# Altium project TesisDextra.PrjPCB
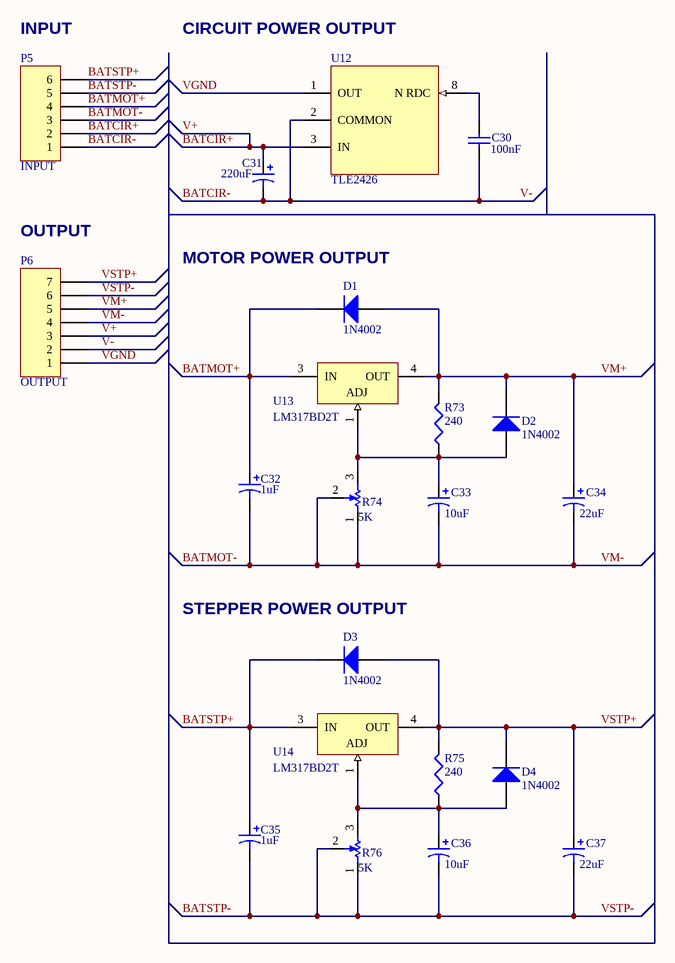
[diagram p0: PowerScr.SchDoc]
5 sheets, 228 parts. Net scope: global (net labels, ports and power ports of the same name join across sheets).
Sheets:
  PowerScr.SchDoc
  EmgAcq.SchDoc
  MDrive.SchDoc
  Hand Sensors.SchDoc
  MCUPro.SchDoc

## Sheet PowerScr.SchDoc: Power Scr Dextra
size A4 portrait; Author: Julio Alvarez D; DrawnBy: Julio Alvarez

### Parts
C30  value 100nF  [RAD-0.2]  (hidden comment: Cap)
C31  value 220uF  [C100UFB]  (hidden comment: Cap Pol1)
C32  value 1uF  [3528]  (hidden comment: 593D105X0020B2)
C33  value 10uF  [7343]  (hidden comment: 593D226X0020D2)
C34  value 22uF  [7343]  (hidden comment: 593D226X0020D2)
C35  value 1uF  [3528]  (hidden comment: 593D105X0020B2)
C36  value 10uF  [7343]  (hidden comment: 593D226X0020D2)
C37  value 22uF  [7343]  (hidden comment: 593D226X0020D2)
D1  1N4002  [DO-41]
D2  1N4002  [DO-41]
D3  1N4002  [DO-41]
D4  1N4002  [DO-41]
P5  INPUT  [AZUL5-6]
P6  OUTPUT  [AZUL5-7]
R73  value 240  [RESC6332M]  (hidden comment: Res3)
R74  value 5K  [3361P]  (hidden comment: POT3361)
R75  value 240  [RESC6332M]  (hidden comment: Res3)
R76  value 5K  [3361P]  (hidden comment: POT3361)
U12  TLE2426  [SOP8 - duplicate]
U13  LM317BD2T  [936-03]
U14  LM317BD2T  [936-03]

### Nets
BATMOT-: C32.2 C33.2 C34.2 C35.2 C36.2 C37.2 P5.3 P5.5 P6.1 P6.4 P6.6 R74.1 R74.2 R76.1 R76.2 U12.1(OUT)  [also labelled BATSTP-, VGND, VM-, VSTP-]
BATCIR+: C31.1 P5.2 P6.3 U12.3(IN)  [also labelled V+]
BATCIR-: C30.1 C31.2 P5.1 P6.2 U12.2(COMMON)  [also labelled V-]
BATMOT+: C32.1 D1.2(K) P5.4 U13.3(IN)
BATSTP+: C35.1 D3.2(K) P5.6 U14.3(IN)
VM+: C34.1 D1.1(A) D2.2(K) P6.5 R73.2 U13.4(OUT)
VSTP+: C37.1 D3.1(A) D4.2(K) P6.7 R75.2 U14.4(OUT)
NetC30_2: C30.2 U12.8(N_RDC)
NetC33_1: C33.1 D2.1(A) R73.1 R74.3 U13.1(ADJ)
NetC36_1: C36.1 D4.1(A) R75.1 R76.3 U14.1(ADJ)

Not connected (* = marked no-connect by the designer): U12 4(NC) 5(NC) 6(NC) 7(NC)

### Notes on the sheet
- (near P5) INPUT
- CIRCUIT POWER OUTPUT
- (near P6) OUTPUT
- MOTOR POWER OUTPUT
- (near D3) STEPPER POWER OUTPUT

### Library data of the parts
C30 = Cap: Capacitor; Published: 8-Jun-2000; LatestRevisionDate: 17-Jul-2002; LatestRevisionNote: Re-released for DXP Platform.; PackageReference: RAD-0.3; Publisher: Altium Limited; PackageDescription: Radial Cap, Thru-Hole; 2 Leads; 0.3 in Pin Spacing
C31 = Cap Pol1: Polarized Capacitor (Radial); Published: 8-Jun-2000; LatestRevisionDate: 17-Jul-2002; LatestRevisionNote: Re-released for DXP Platform.; PackageReference: RB7.6-15; Publisher: Altium Limited; PackageDescription: Polarized Capacitor (Radial); 2 Leads
C32 C35 = 593D106X0020B2: Tantamount Commercial, Surface Mount Solid Tantalum Chip Capacitor for Switch Mode Power Supplies and Converters: 10uF, 20% Tolerance, 20 WVDC @ +85°C, Surge = 26V; Note: See Data Sheet for full range of components; Published: 19-Mar-2004; DatasheetDocument: 04-Mar-2003; PackageReference: 3528; Publisher: Altium Limited; Code_JEITA: 3528; ComponentLink1Description: Manufacturer Link; ComponentLink1URL: http://www.vishay.com/; ComponentLink2Description: Datasheet; ComponentLink2URL: http://www.vishay.com/docs/40005/593.pdf
C33 C34 C36 C37 = 593D226X0020D2: Tantamount Commercial, Surface Mount Solid Tantalum Chip Capacitor for Switch Mode Power Supplies and Converters: 22uF, 20% Tolerance, 20 WVDC @ +85°C, Surge = 26V; Note: See Data Sheet for full range of components; Published: 19-Mar-2004; DatasheetDocument: 04-Mar-2003; PackageReference: 7343; Publisher: Altium Limited; Code_JEITA: 7343; ComponentLink1Description: Manufacturer Link; ComponentLink1URL: http://www.vishay.com/; ComponentLink2Description: Datasheet; ComponentLink2URL: http://www.vishay.com/docs/40005/593.pdf
D1-D4 = Diode 1N4002: 1 Amp General Purpose Rectifier; Published: 8-Jun-2000; LatestRevisionDate: 17-Jul-2002; LatestRevisionNote: Re-released for DXP Platform.; DatasheetVersion: 1998; PackageVersion: Aug-1999; PackageReference: DO-41; Publisher: Altium Limited; PackageDescription: Diode, Axial; Body 5.2 x 2.7 mm (LxDia. max), Lead Dia. 0.86 mm (max); Code_JEDEC: DO-204-AL; ComponentLink1Description: Manufacturer Link; ComponentLink1URL: http://www.fairchildsemi.com/; ComponentLink2Description: Datasheet; ComponentLink2URL: http://www.fairchildsemi.com/ds/1N%2F1N4001.pdf
P5 = Header 6: Header, 6-Pin; LatestRevisionDate: 17-Jul-2002; LatestRevisionNote: Re-released for DXP Platform.; Publisher: Altium Limited
P6 = Header 7: Header, 7-Pin; LatestRevisionDate: 17-Jul-2002; LatestRevisionNote: Re-released for DXP Platform.; Publisher: Altium Limited
R73 R75 = Res3: Resistor; Published: 8-Jun-2000; LatestRevisionDate: 29-May-2009; LatestRevisionNote: IPC-7351 Footprint Added.; PackageReference: J1-0603; Publisher: Altium Limited; PackageDescription: Chip Resistor
U12 = TLE2426: Precision Virtual Ground
U13 U14 = LM317BD2T: Three-Terminal Adjustable Output Positive Voltage Regulator; Note: Pin 2 is electrically connected to Pin 4; Pin 4 is heasink; Published: 15-Apr-2002; DatasheetVersion: 1996; PackageVersion: 1997; PackageReference: 936-03; Publisher: Altium Limited; PackageDescription: D2-PAK/TO-263-AB; 3 Leads (1 Cropped); Body 14.7 (inc. leads) x 10.2 mm (LxW max); ComponentLink1Description: Manufacturer Link; ComponentLink1URL: http://www.onsemi.com/site/products/taxonomy/0,4438,503,00.html; ComponentLink2Description: Datasheet; ComponentLink2URL: http://www.onsemi.com/pub/Collateral/LM317-D.PDF

## Sheet EmgAcq.SchDoc: EMG ACQ-4
size A3; DrawnBy: Julio Alvarez D
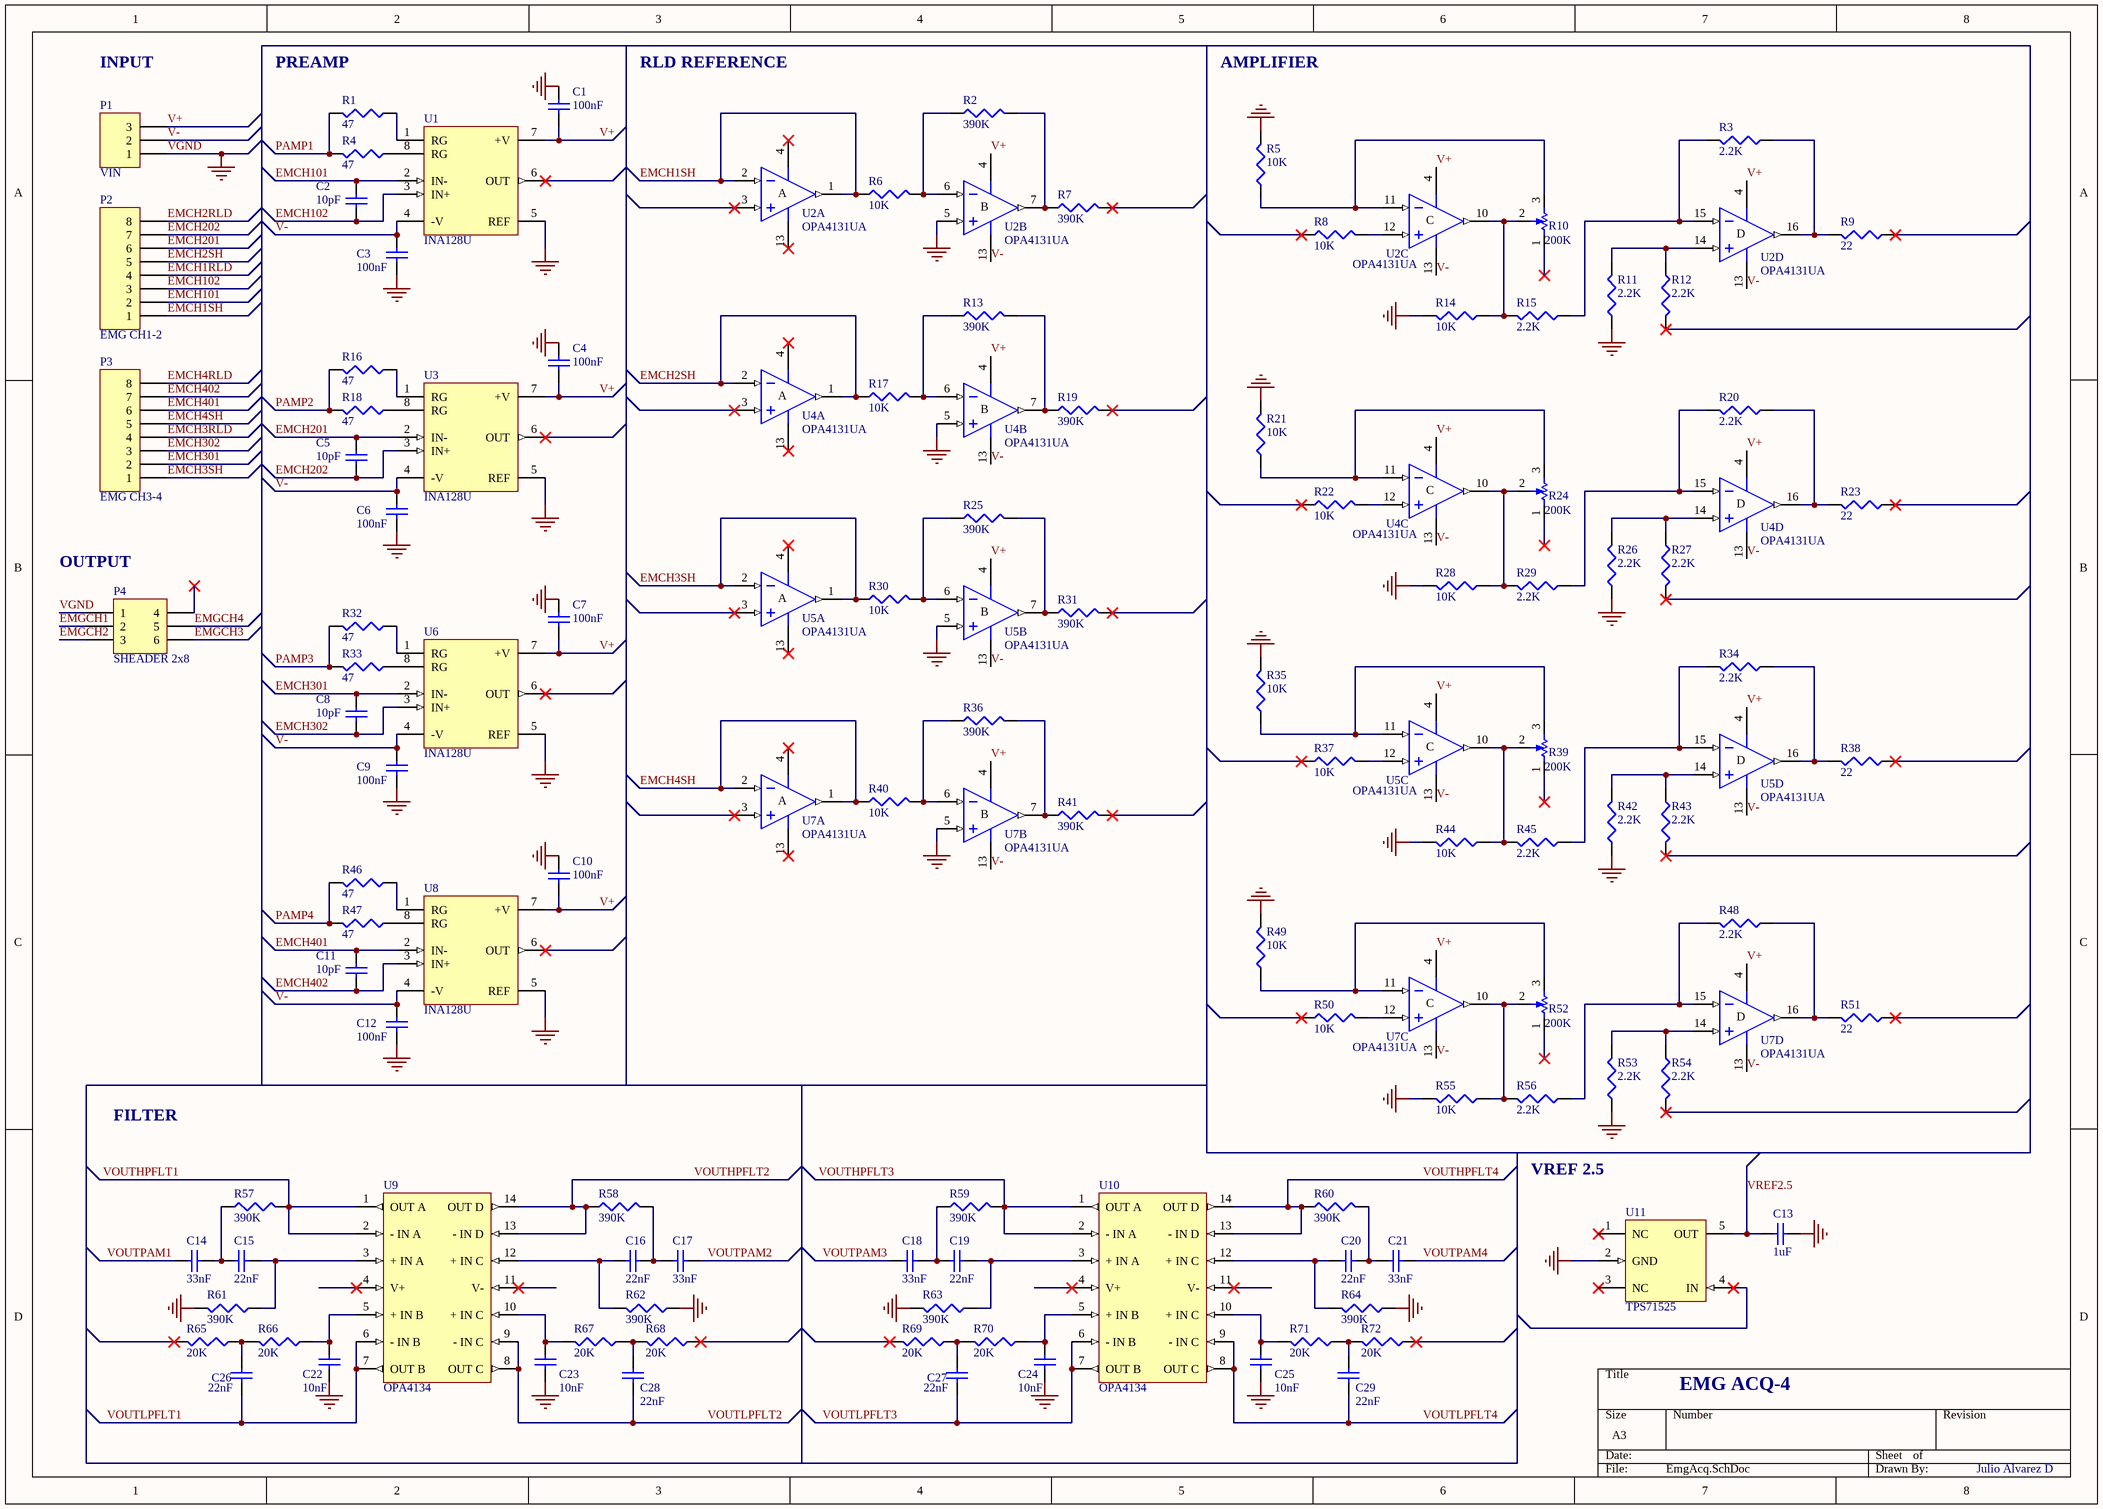
[diagram p1: EmgAcq.SchDoc]

### Parts
C1  value 100nF  [C1206]  (hidden comment: Cap Semi)
C2  value 10pF  [C1206]  (hidden comment: Cap Semi)
C3  value 100nF  [C1206]  (hidden comment: Cap Semi)
C4  value 100nF  [C1206]  (hidden comment: Cap Semi)
C5  value 10pF  [C1206]  (hidden comment: Cap Semi)
C6  value 100nF  [C1206]  (hidden comment: Cap Semi)
C7  value 100nF  [C1206]  (hidden comment: Cap Semi)
C8  value 10pF  [C1206]  (hidden comment: Cap Semi)
C9  value 100nF  [C1206]  (hidden comment: Cap Semi)
C10  value 100nF  [C1206]  (hidden comment: Cap Semi)
C11  value 10pF  [C1206]  (hidden comment: Cap Semi)
C12  value 100nF  [C1206]  (hidden comment: Cap Semi)
C13  value 1uF  [CAPC2012M]  (hidden comment: Cap Semi)
C14  value 33nF  [C1206]  (hidden comment: Cap Semi)
C15  value 22nF  [1608[0603]]  (hidden comment: Cap Semi)
C16  value 22nF  [1608[0603]]  (hidden comment: Cap Semi)
C17  value 33nF  [C1206]  (hidden comment: Cap Semi)
C18  value 33nF  [C1206]  (hidden comment: Cap Semi)
C19  value 22nF  [1608[0603]]  (hidden comment: Cap Semi)
C20  value 22nF  [1608[0603]]  (hidden comment: Cap Semi)
C21  value 33nF  [C1206]  (hidden comment: Cap Semi)
C22  value 10nF  [C1206]  (hidden comment: Cap Semi)
C23  value 10nF  [C1206]  (hidden comment: Cap Semi)
C24  value 10nF  [C1206]  (hidden comment: Cap Semi)
C25  value 10nF  [C1206]  (hidden comment: Cap Semi)
C26  value 22nF  [1608[0603]]  (hidden comment: Cap Semi)
C27  value 22nF  [1608[0603]]  (hidden comment: Cap Semi)
C28  value 22nF  [1608[0603]]  (hidden comment: Cap Semi)
C29  value 22nF  [1608[0603]]  (hidden comment: Cap Semi)
P1  VIN  [AZUL5-3]
P2  EMG CH1-2  [AZUL5-8]
P3  EMG CH3-4  [AZUL5-8]
P4  SHEADER 2x8  [SHBH 2x3]
R1  value 47  [RESC3225M]  (hidden comment: Res3)
R2  value 390K  [RESC3225M]  (hidden comment: Res3)
R3  value 2.2K  [RESC3225M]  (hidden comment: Res3)
R4  value 47  [RESC3225M]  (hidden comment: Res3)
R5  value 10K  [RESC3225M]  (hidden comment: Res3)
R6  value 10K  [RESC3225M]  (hidden comment: Res3)
R7  value 390K  [RESC3225M]  (hidden comment: Res3)
R8  value 10K  [RESC3225M]  (hidden comment: Res3)
R9  value 22  [RESC3225M]  (hidden comment: Res3)
R10  POT3361  [3361P]  (value not drawn)
R11  value 2.2K  [RESC3225M]  (hidden comment: Res3)
R12  value 2.2K  [RESC3225M]  (hidden comment: Res3)
R13  value 390K  [RESC3225M]  (hidden comment: Res3)
R14  value 10K  [RESC3225M]  (hidden comment: Res3)
R15  value 2.2K  [RESC3225M]  (hidden comment: Res3)
R16  value 47  [RESC3225M]  (hidden comment: Res3)
R17  value 10K  [RESC3225M]  (hidden comment: Res3)
R18  value 47  [RESC3225M]  (hidden comment: Res3)
R19  value 390K  [RESC3225M]  (hidden comment: Res3)
R20  value 2.2K  [RESC3225M]  (hidden comment: Res3)
R21  value 10K  [RESC3225M]  (hidden comment: Res3)
R22  value 10K  [RESC3225M]  (hidden comment: Res3)
R23  value 22  [RESC3225M]  (hidden comment: Res3)
R24  POT3361  [3361P]  (value not drawn)
R25  value 390K  [RESC3225M]  (hidden comment: Res3)
R26  value 2.2K  [RESC3225M]  (hidden comment: Res3)
R27  value 2.2K  [RESC3225M]  (hidden comment: Res3)
R28  value 10K  [RESC3225M]  (hidden comment: Res3)
R29  value 2.2K  [RESC3225M]  (hidden comment: Res3)
R30  value 10K  [RESC3225M]  (hidden comment: Res3)
R31  value 390K  [RESC3225M]  (hidden comment: Res3)
R32  value 47  [RESC3225M]  (hidden comment: Res3)
R33  value 47  [RESC3225M]  (hidden comment: Res3)
R34  value 2.2K  [RESC3225M]  (hidden comment: Res3)
R35  value 10K  [RESC3225M]  (hidden comment: Res3)
R36  value 390K  [RESC3225M]  (hidden comment: Res3)
R37  value 10K  [RESC3225M]  (hidden comment: Res3)
R38  value 22  [RESC3225M]  (hidden comment: Res3)
R39  POT3361  [3361P]  (value not drawn)
R40  value 10K  [RESC3225M]  (hidden comment: Res3)
R41  value 390K  [RESC3225M]  (hidden comment: Res3)
R42  value 2.2K  [RESC3225M]  (hidden comment: Res3)
R43  value 2.2K  [RESC3225M]  (hidden comment: Res3)
R44  value 10K  [RESC3225M]  (hidden comment: Res3)
R45  value 2.2K  [RESC3225M]  (hidden comment: Res3)
R46  value 47  [RESC3225M]  (hidden comment: Res3)
R47  value 47  [RESC3225M]  (hidden comment: Res3)
R48  value 2.2K  [RESC3225M]  (hidden comment: Res3)
R49  value 10K  [RESC3225M]  (hidden comment: Res3)
R50  value 10K  [RESC3225M]  (hidden comment: Res3)
R51  value 22  [RESC3225M]  (hidden comment: Res3)
R52  POT3361  [3361P]  (value not drawn)
R53  value 2.2K  [RESC3225M]  (hidden comment: Res3)
R54  value 2.2K  [RESC3225M]  (hidden comment: Res3)
R55  value 10K  [RESC3225M]  (hidden comment: Res3)
R56  value 2.2K  [RESC3225M]  (hidden comment: Res3)
R57  value 390K  [RESC3225M]  (hidden comment: Res3)
R58  value 390K  [RESC3225M]  (hidden comment: Res3)
R59  value 390K  [RESC3225M]  (hidden comment: Res3)
R60  value 390K  [RESC3225M]  (hidden comment: Res3)
R61  value 390K  [RESC3225M]  (hidden comment: Res3)
R62  value 390K  [RESC3225M]  (hidden comment: Res3)
R63  value 390K  [RESC3225M]  (hidden comment: Res3)
R64  value 390K  [RESC3225M]  (hidden comment: Res3)
R65  value 20K  [RESC3225M]  (hidden comment: Res3)
R66  value 20K  [RESC3225M]  (hidden comment: Res3)
R67  value 20K  [RESC3225M]  (hidden comment: Res3)
R68  value 20K  [RESC3225M]  (hidden comment: Res3)
R69  value 20K  [RESC3225M]  (hidden comment: Res3)
R70  value 20K  [RESC3225M]  (hidden comment: Res3)
R71  value 20K  [RESC3225M]  (hidden comment: Res3)
R72  value 20K  [RESC3225M]  (hidden comment: Res3)
U1  INA128U  [182H_N]
U2  OPA4131UA  [211F_N]  (parts A,B,C,D of 4)
U3  INA128U  [182H_N]
U4  OPA4131UA  [211F_N]  (parts A,B,C,D of 4)
U5  OPA4131UA  [211F_N]  (parts A,B,C,D of 4)
U6  INA128U  [182H_N]
U7  OPA4131UA  [211F_N]  (parts A,B,C,D of 4)
U8  INA128U  [182H_N]
U9  OPA4134  [SOIC127P600-14M]
U10  OPA4134  [SOIC127P600-14M]
U11  TPS71525  [SOT353-5L]

### Nets
GND: C1.2 C3.1 C4.2 C6.1 C7.2 C9.1 C10.2 C12.1 C13.2 C22.1 C23.1 C24.1 C25.1 P1.1 P4.1 R5.1 R11.2 R14.1 R21.1 R26.2 R28.1 R35.1 R42.2 R44.1 R49.1 R53.2 R55.1 R61.2 R62.2 R63.2 R64.2 U1.5(REF) U2.5(IN+) U3.5(REF) U4.5(IN+) U5.5(IN+) U6.5(REF) U7.5(IN+) U8.5(REF) U11.2(GND)  [also labelled VGND]  [project net BATMOT-]
EMCH1RLD: P2.4
EMCH1SH: P2.1 R6.1 U2.1(OUT) U2.2(IN-)
EMCH2RLD: P2.8
EMCH2SH: P2.5 R17.1 U4.1(OUT) U4.2(IN-)
EMCH3RLD: P3.4
EMCH3SH: P3.1 R30.1 U5.1(OUT) U5.2(IN-)
EMCH4RLD: P3.8
EMCH4SH: P3.5 R40.1 U7.1(OUT) U7.2(IN-)
EMCH101: C2.2 P2.2 U1.2(IN-)
EMCH102: C2.1 P2.3 U1.3(IN+)
EMCH201: C5.2 P2.6 U3.2(IN-)
EMCH202: C5.1 P2.7 U3.3(IN+)
EMCH301: C8.2 P3.2 U6.2(IN-)
EMCH302: C8.1 P3.3 U6.3(IN+)
EMCH401: C11.2 P3.6 U8.2(IN-)
EMCH402: C11.1 P3.7 U8.3(IN+)
EMGCH1: P4.2
EMGCH2: P4.3
EMGCH3: P4.6
EMGCH4: P4.5
PAMP1: R1.2 R4.2
PAMP2: R16.2 R18.2
PAMP3: R32.2 R33.2
PAMP4: R46.2 R47.2
V+: C1.1 C4.1 C7.1 C10.1 P1.3 U1.7(+V) U2.4(V+) U3.7(+V) U4.4(V+) U5.4(V+) U6.7(+V) U7.4(V+) U8.7(+V)  [project net BATCIR+]
V-: C3.2 C6.2 C9.2 C12.2 P1.2 U1.4(-V) U2.13(V-) U3.4(-V) U4.13(V-) U5.13(V-) U6.4(-V) U7.13(V-) U8.4(-V)  [project net BATCIR-]
VOUTHPFLT1: R57.2 U9.1(OUT_A) U9.2(-_IN_A)
VOUTHPFLT2: R58.2 U9.13(-_IN_D) U9.14(OUT_D)
VOUTHPFLT3: R59.2 U10.1(OUT_A) U10.2(-_IN_A)
VOUTHPFLT4: R60.2 U10.13(-_IN_D) U10.14(OUT_D)
VOUTLPFLT1: C26.1 U9.6(-_IN_B) U9.7(OUT_B)
VOUTLPFLT2: C28.1 U9.8(OUT_C) U9.9(-_IN_C)
VOUTLPFLT3: C27.1 U10.6(-_IN_B) U10.7(OUT_B)
VOUTLPFLT4: C29.1 U10.8(OUT_C) U10.9(-_IN_C)
VOUTPAM1: C14.2
VOUTPAM2: C17.2
VOUTPAM3: C18.2
VOUTPAM4: C21.2
VREF2.5: C13.1 U11.5(OUT)
NetC14_1: C14.1 C15.2 R57.1
NetC15_1: C15.1 R61.1 U9.3(+_IN_A)
NetC16_1: C16.1 R62.1 U9.12(+_IN_C)
NetC16_2: C16.2 C17.1 R58.1
NetC18_1: C18.1 C19.2 R59.1
NetC19_1: C19.1 R63.1 U10.3(+_IN_A)
NetC20_1: C20.1 R64.1 U10.12(+_IN_C)
NetC20_2: C20.2 C21.1 R60.1
NetC22_2: C22.2 R66.1 U9.5(+_IN_B)
NetC23_2: C23.2 R67.1 U9.10(+_IN_C)
NetC24_2: C24.2 R70.1 U10.5(+_IN_B)
NetC25_2: C25.2 R71.1 U10.10(+_IN_C)
NetC26_2: C26.2 R65.1 R66.2
NetC27_2: C27.2 R69.1 R70.2
NetC28_2: C28.2 R67.2 R68.1
NetC29_2: C29.2 R71.2 R72.1
NetR1_1: R1.1 U1.1(RG)
NetR2_1: R2.1 R6.2 U2.6(IN-)
NetR2_2: R2.2 R7.1 U2.7(OUT)
NetR3_1: R3.1 R15.2 U2.15(IN-)
NetR3_2: R3.2 R9.1 U2.16(OUT)
NetR4_1: R4.1 U1.8(RG)
NetR5_2: R5.2 R10.3 U2.11(IN-)
NetR8_1: R8.1 U2.12(IN+)
NetR10_2: R10.2 R14.2 R15.1 U2.10(OUT)
NetR11_1: R11.1 R12.2 U2.14(IN+)
NetR13_1: R13.1 R17.2 U4.6(IN-)
NetR13_2: R13.2 R19.1 U4.7(OUT)
NetR16_1: R16.1 U3.1(RG)
NetR18_1: R18.1 U3.8(RG)
NetR20_1: R20.1 R29.2 U4.15(IN-)
NetR20_2: R20.2 R23.1 U4.16(OUT)
NetR21_2: R21.2 R24.3 U4.11(IN-)
NetR22_1: R22.1 U4.12(IN+)
NetR24_2: R24.2 R28.2 R29.1 U4.10(OUT)
NetR25_1: R25.1 R30.2 U5.6(IN-)
NetR25_2: R25.2 R31.1 U5.7(OUT)
NetR26_1: R26.1 R27.2 U4.14(IN+)
NetR32_1: R32.1 U6.1(RG)
NetR33_1: R33.1 U6.8(RG)
NetR34_1: R34.1 R45.2 U5.15(IN-)
NetR34_2: R34.2 R38.1 U5.16(OUT)
NetR35_2: R35.2 R39.3 U5.11(IN-)
NetR36_1: R36.1 R40.2 U7.6(IN-)
NetR36_2: R36.2 R41.1 U7.7(OUT)
NetR37_1: R37.1 U5.12(IN+)
NetR39_2: R39.2 R44.2 R45.1 U5.10(OUT)
NetR42_1: R42.1 R43.2 U5.14(IN+)
NetR46_1: R46.1 U8.1(RG)
NetR47_1: R47.1 U8.8(RG)
NetR48_1: R48.1 R56.2 U7.15(IN-)
NetR48_2: R48.2 R51.1 U7.16(OUT)
NetR49_2: R49.2 R52.3 U7.11(IN-)
NetR50_1: R50.1 U7.12(IN+)
NetR52_2: R52.2 R55.2 R56.1 U7.10(OUT)
NetR53_1: R53.1 R54.2 U7.14(IN+)

Not connected (* = marked no-connect by the designer): P4 4*; R7 2*; R8 2*; R9 2*; R10 1*; R12 1*; R19 2*; R22 2*; R23 2*; R24 1*; R27 1*; R31 2*; R37 2*; R38 2*; R39 1*; R41 2*; R43 1*; R50 2*; R51 2*; R52 1*; R54 1*; R65 2*; R68 2*; R69 2*; R72 2*; U1 6(OUT)*; U2 3(IN+)*; U3 6(OUT)*; U4 3(IN+)*; U5 3(IN+)*; U6 6(OUT)*; U7 3(IN+)*; U8 6(OUT)*; U9 4(V+)* 11(V-)*; U10 4(V+)* 11(V-)*; U11 1(NC)* 3(NC)* 4(IN)*

### Notes on the sheet
- INPUT
- (near R1) PREAMP
- RLD REFERENCE
- AMPLIFIER
- (near P4) OUTPUT
- FILTER
- VREF 2.5
- (in symbol OPA4131UA, part A) A
- (in symbol OPA4131UA, part B) B
- (in symbol OPA4131UA, part C) C
- (in symbol OPA4131UA, part D) D
- (in symbol POT3361) 200K

### Library data of the parts
C1-C29 = Cap Semi: Capacitor (Semiconductor SIM Model); Published: 8-Jun-2000; LatestRevisionDate: 29-May-2009; LatestRevisionNote: IPC-7351 Footprint Added.; PackageReference: C1206; Publisher: Altium Limited; PackageDescription: Chip Capacitor
P1 = Header 3: Header, 3-Pin; LatestRevisionDate: 17-Jul-2002; LatestRevisionNote: Re-released for DXP Platform.; Publisher: Altium Limited
P2 P3 = Header 8: Header, 8-Pin; LatestRevisionDate: 17-Jul-2002; LatestRevisionNote: Re-released for DXP Platform.; Publisher: Altium Limited
P4 = SB Header 2x3: Shrouded Box Header: 2x8-Pin, 0.100" (2.54 mm) Male
R1-R9 R11-R23 R25-R38 R40-R51 R53-R72 = Res3: Resistor; Published: 8-Jun-2000; LatestRevisionDate: 29-May-2009; LatestRevisionNote: IPC-7351 Footprint Added.; PackageReference: J1-0603; Publisher: Altium Limited; PackageDescription: Chip Resistor
U1 U3 U6 U8 = INA128U: Precision, Low-Power Instrumentation Amplifiers; Published: 8-Jun-2000; LatestRevisionDate: 13-Apr-2006; LatestRevisionNote: IPC-7351 Footprint Added.; DatasheetVersion: Oct-1996; PackageReference: 182H; Publisher: Altium Limited; PackageDescription: 8-Pin Small Outline Integrated Circuit 1.27 mm Pitch; Code_JEDEC: MS-012-AA; Code_IPC: SOIC127P600-8; ComponentLink1Description: Manufacturer Link; ComponentLink1URL: http://www.ti.com/; ComponentLink2Description: Datasheet; ComponentLink2URL: http://www-s.ti.com/sc/ds/INA128.pdf
U2 U4 U5 U7 = OPA4131UA: General Purpose FET-Input Operational Amplifiers; Note: Pins 8 and 9 are No internal Connection (NC) pins and are not drawn.; Published: 8-Jun-2000; LatestRevisionDate: 13-Apr-2006; LatestRevisionNote: IPC-7351 Footprint Added.; DatasheetVersion: Jan-1996; PackageReference: 211F; Publisher: Altium Limited; PackageDescription: 16-Pin Small Outline Integrated Circuit 1.27 mm Pitch; Code_JEDEC: MS-013-AA; Code_IPC: SOIC127P1030-16; ComponentLink1Description: Manufacturer Link; ComponentLink1URL: http://www.ti.com/; ComponentLink2Description: Datasheet; ComponentLink2URL: http://www-s.ti.com/sc/ds/OPA131.pdf

## Sheet MDrive.SchDoc: M Drive M8S1
size A4 portrait
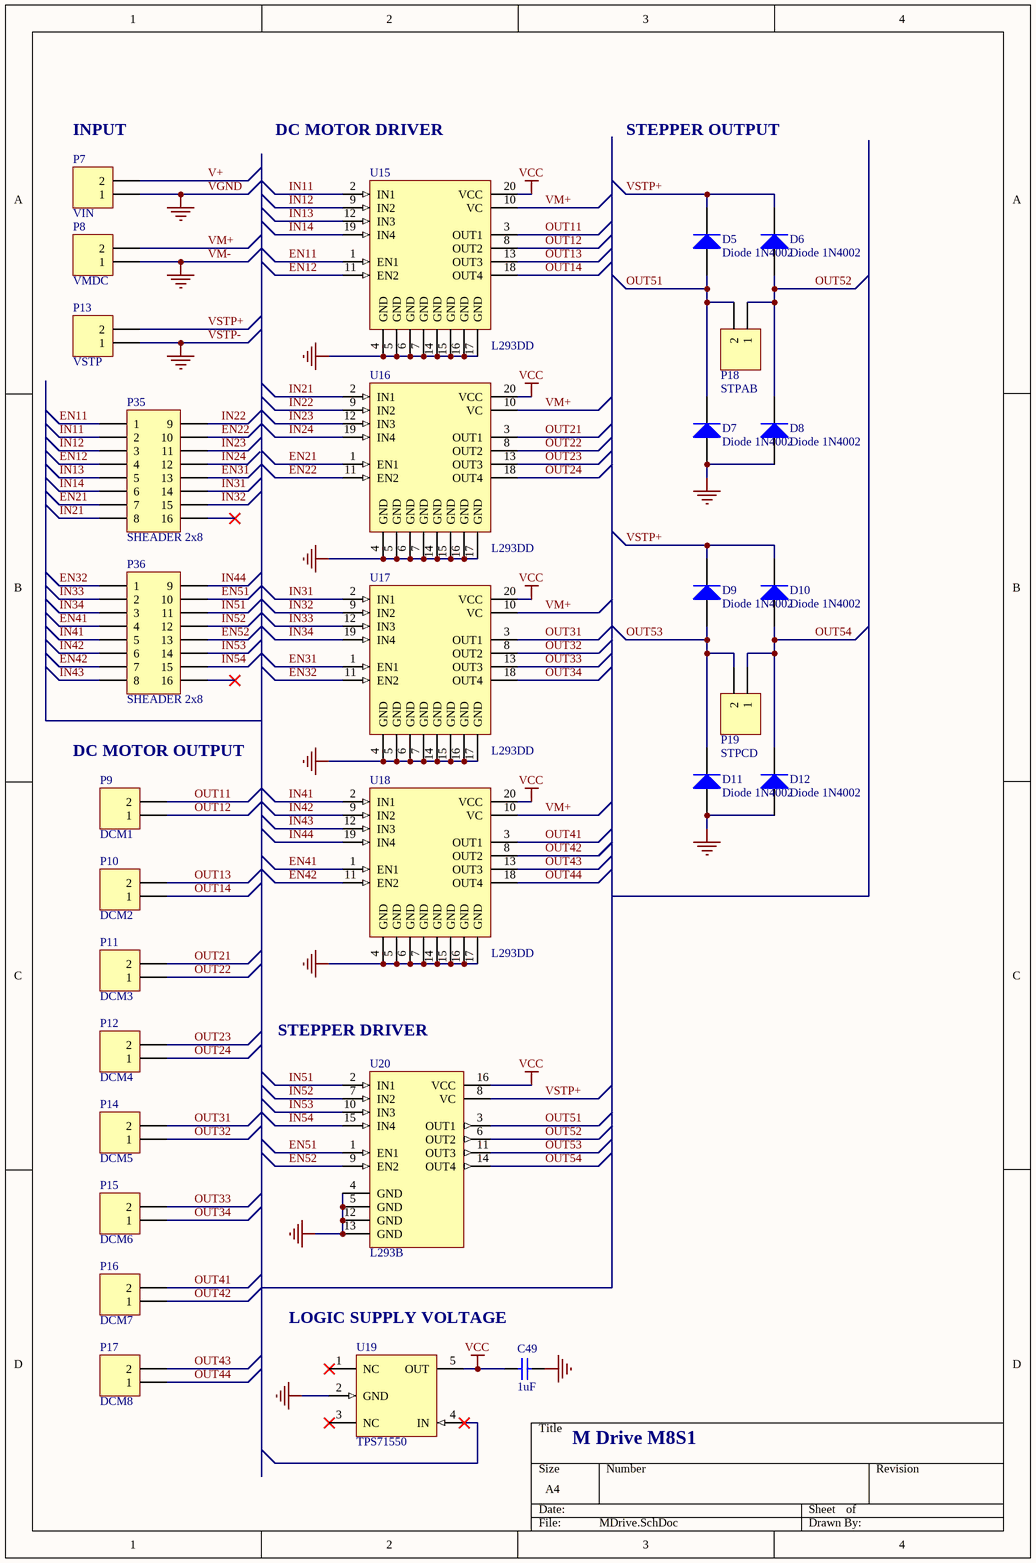
[diagram p2: MDrive.SchDoc]

### Parts
C49  value 1uF  [CAPC2012M]  (hidden comment: Cap Semi)
D5  Diode 1N4002  [DO-41]
D6  Diode 1N4002  [DO-41]
D7  Diode 1N4002  [DO-41]
D8  Diode 1N4002  [DO-41]
D9  Diode 1N4002  [DO-41]
D10  Diode 1N4002  [DO-41]
D11  Diode 1N4002  [DO-41]
D12  Diode 1N4002  [DO-41]
P7  VIN  [AZUL5-2]
P8  VMDC  [AZUL5-2]
P9  DCM1  [AZUL5-2]
P10  DCM2  [AZUL5-2]
P11  DCM3  [AZUL5-2]
P12  DCM4  [AZUL5-2]
P13  VSTP  [AZUL5-2]
P14  DCM5  [AZUL5-2]
P15  DCM6  [AZUL5-2]
P16  DCM7  [AZUL5-2]
P17  DCM8  [AZUL5-2]
P18  STPAB  [AZUL5-2]
P19  STPCD  [AZUL5-2]
P35  SHEADER 2x8  [SHBH 2X8]
P36  SHEADER 2x8  [SHBH 2X8]
U15  L293DD  [SO20_N]
U16  L293DD  [SO20_N]
U17  L293DD  [SO20_N]
U18  L293DD  [SO20_N]
U19  TPS71550  [SOT353-5L]
U20  L293B  [DIP16]

### Nets
GND: C49.2 D7.1(A) D8.1(A) D11.1(A) D12.1(A) P7.1 P8.1 P13.1 U15.4(GND) U15.5(GND) U15.6(GND) U15.7(GND) U15.14(GND) U15.15(GND) U15.16(GND) U15.17(GND) U16.4(GND) U16.5(GND) U16.6(GND) U16.7(GND) U16.14(GND) U16.15(GND) U16.16(GND) U16.17(GND) U17.4(GND) U17.5(GND) U17.6(GND) U17.7(GND) U17.14(GND) U17.15(GND) U17.16(GND) U17.17(GND) U18.4(GND) U18.5(GND) U18.6(GND) U18.7(GND) U18.14(GND) U18.15(GND) U18.16(GND) U18.17(GND) U19.2(GND) U20.4(GND) U20.5(GND) U20.12(GND) U20.13(GND)  [also labelled VGND, VM-, VSTP-]  [project net BATMOT-]
VCC: C49.1 U15.20(VCC) U16.20(VCC) U17.20(VCC) U18.20(VCC) U19.5(OUT) U20.16(VCC)  [project net FSR11]
EN11: P35.1 U15.1(EN1)
EN12: P35.4 U15.11(EN2)
EN21: P35.7 U16.1(EN1)
EN22: P35.10 U16.11(EN2)
EN31: P35.13 U17.1(EN1)
EN32: P36.1 U17.11(EN2)
EN41: P36.4 U18.1(EN1)
EN42: P36.7 U18.11(EN2)
EN51: P36.10 U20.1(EN1)
EN52: P36.13 U20.9(EN2)
IN11: P35.2 U15.2(IN1)
IN12: P35.3 U15.9(IN2)
IN13: P35.5 U15.12(IN3)
IN14: P35.6 U15.19(IN4)
IN21: P35.8 U16.2(IN1)
IN22: P35.9 U16.9(IN2)
IN23: P35.11 U16.12(IN3)
IN24: P35.12 U16.19(IN4)
IN31: P35.14 U17.2(IN1)
IN32: P35.15 U17.9(IN2)
IN33: P36.2 U17.12(IN3)
IN34: P36.3 U17.19(IN4)
IN41: P36.5 U18.2(IN1)
IN42: P36.6 U18.9(IN2)
IN43: P36.8 U18.12(IN3)
IN44: P36.9 U18.19(IN4)
IN51: P36.11 U20.2(IN1)
IN52: P36.12 U20.7(IN2)
IN53: P36.14 U20.10(IN3)
IN54: P36.15 U20.15(IN4)
OUT11: P9.2 U15.3(OUT1)
OUT12: P9.1 U15.8(OUT2)
OUT13: P10.2 U15.13(OUT3)
OUT14: P10.1 U15.18(OUT4)
OUT21: P11.2 U16.3(OUT1)
OUT22: P11.1 U16.8(OUT2)
OUT23: P12.2 U16.13(OUT3)
OUT24: P12.1 U16.18(OUT4)
OUT31: P14.2 U17.3(OUT1)
OUT32: P14.1 U17.8(OUT2)
OUT33: P15.2 U17.13(OUT3)
OUT34: P15.1 U17.18(OUT4)
OUT41: P16.2 U18.3(OUT1)
OUT42: P16.1 U18.8(OUT2)
OUT43: P17.2 U18.13(OUT3)
OUT44: P17.1 U18.18(OUT4)
OUT51: D5.1(A) D7.2(K) P18.2 U20.3(OUT1)
OUT52: D6.1(A) D8.2(K) P18.1 U20.6(OUT2)
OUT53: D9.1(A) D11.2(K) P19.2 U20.11(OUT3)
OUT54: D10.1(A) D12.2(K) P19.1 U20.14(OUT4)
V+: P7.2  [project net BATCIR+]
VM+: P8.2 U15.10(VC) U16.10(VC) U17.10(VC) U18.10(VC)
VSTP+: D5.2(K) D6.2(K) D9.2(K) D10.2(K) P13.2 U20.8(VC)

Not connected (* = marked no-connect by the designer): P35 16*; P36 16*; U19 1(NC)* 3(NC)* 4(IN)*

### Notes on the sheet
- (near P7) INPUT
- DC MOTOR DRIVER
- STEPPER OUTPUT
- DC MOTOR OUTPUT
- (near U20) STEPPER DRIVER
- (near U19) LOGIC SUPPLY VOLTAGE

### Library data of the parts
C49 = Cap Semi: Capacitor (Semiconductor SIM Model); Published: 8-Jun-2000; LatestRevisionDate: 29-May-2009; LatestRevisionNote: IPC-7351 Footprint Added.; PackageReference: C1206; Publisher: Altium Limited; PackageDescription: Chip Capacitor
D5-D12 = Diode 1N4002: 1 Amp General Purpose Rectifier; Published: 8-Jun-2000; LatestRevisionDate: 17-Jul-2002; LatestRevisionNote: Re-released for DXP Platform.; DatasheetVersion: 1998; PackageVersion: Aug-1999; PackageReference: DO-41; Publisher: Altium Limited; PackageDescription: Diode, Axial; Body 5.2 x 2.7 mm (LxDia. max), Lead Dia. 0.86 mm (max); Code_JEDEC: DO-204-AL; ComponentLink1Description: Manufacturer Link; ComponentLink1URL: http://www.fairchildsemi.com/; ComponentLink2Description: Datasheet; ComponentLink2URL: http://www.fairchildsemi.com/ds/1N%2F1N4001.pdf
P7-P19 = Header 2: Header, 2-Pin; LatestRevisionDate: 17-Jul-2002; LatestRevisionNote: Re-released for DXP Platform.; Publisher: Altium Limited
P35 P36 = SB Header 2x8: Shrouded Box Header: 2x8-Pin, 0.100" (2.54 mm) Male
U15-U18 = L293DD: Push-Pull Four Channel Driver With Diode; Published: 8-Jun-2000; LatestRevisionDate: 13-Apr-2006; LatestRevisionNote: IPC-7351 Footprint Added.; DatasheetVersion: Jun-1996; PackageVersion: Jul-2001; PackageReference: SO20; Publisher: Altium Limited; PackageDescription: 20-Pin Plastic Small Outline Integrated Circuit 1.27 mm Pitch; Code_JEDEC: MS-013-AC; Code_IPC: SOIC127P1030-20; ComponentLink1Description: Manufacturer Link; ComponentLink1URL: http://www.st.com/; ComponentLink2Description: Datasheet; ComponentLink2URL: http://www.st.com/stonline/products/literature/ds/1330/l293d.pdf
U20 = L293B: Push-Pull Four Channel Drivers; Published: 8-Jun-2000; LatestRevisionDate: 06-Jun-2005; LatestRevisionNote: Stylized 3D Model Added.; DatasheetVersion: Apr-1993; PackageVersion: Apr-1996; PackageReference: DIP16; Publisher: Altium Limited; PackageDescription: DIP; 16 Leads; Row Spacing 7.62 mm; Pitch 2.54 mm; ComponentLink1Description: Manufacturer Link; ComponentLink1URL: http://www.st.com/; ComponentLink2Description: Datasheet; ComponentLink2URL: http://www.st.com/stonline/products/literature/ds/1328/l293b.pdf

## Sheet Hand Sensors.SchDoc
size A
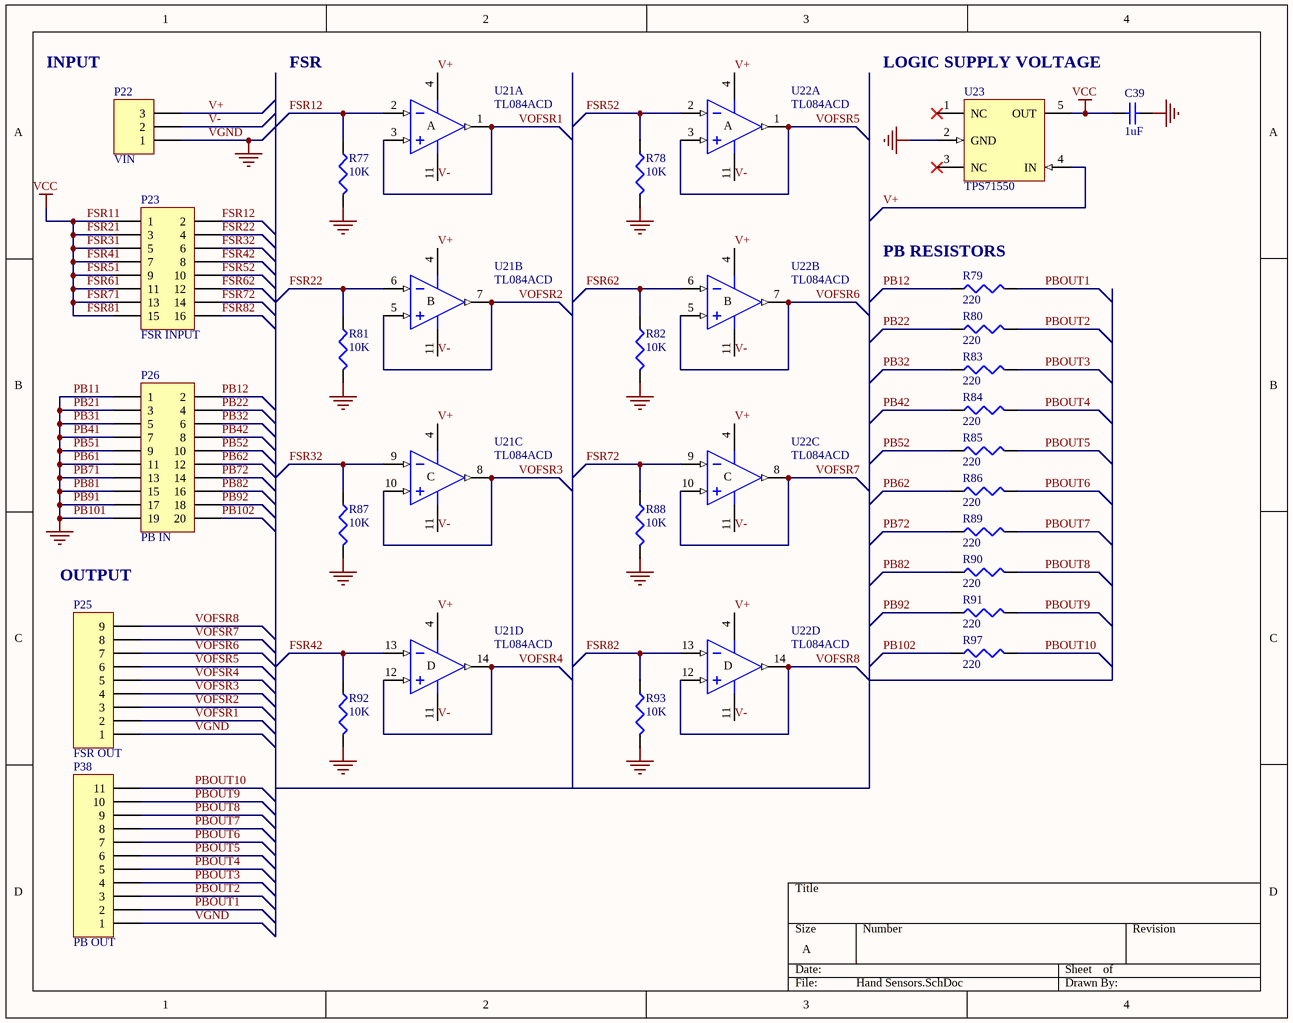
[diagram p3: Hand Sensors.SchDoc]

### Parts
C39  value 1uF  [CAPC2012M]  (hidden comment: Cap Semi)
P22  VIN  [AZUL5-3]
P23  FSR INPUT  [HDR2X8]
P25  FSR OUT  [HDR1X9H]
P26  PB IN  [HDR2X10]
P38  PB OUT  [HDR1X11H]
R77  value 10K  [RESC3225M]  (hidden comment: Res3)
R78  value 10K  [RESC3225M]  (hidden comment: Res3)
R79  value 220  [RESC3225M]  (hidden comment: Res3)
R80  value 220  [RESC3225M]  (hidden comment: Res3)
R81  value 10K  [RESC3225M]  (hidden comment: Res3)
R82  value 10K  [RESC3225M]  (hidden comment: Res3)
R83  value 220  [RESC3225M]  (hidden comment: Res3)
R84  value 220  [RESC3225M]  (hidden comment: Res3)
R85  value 220  [RESC3225M]  (hidden comment: Res3)
R86  value 220  [RESC3225M]  (hidden comment: Res3)
R87  value 10K  [RESC3225M]  (hidden comment: Res3)
R88  value 10K  [RESC3225M]  (hidden comment: Res3)
R89  value 220  [RESC3225M]  (hidden comment: Res3)
R90  value 220  [RESC3225M]  (hidden comment: Res3)
R91  value 220  [RESC3225M]  (hidden comment: Res3)
R92  value 10K  [RESC3225M]  (hidden comment: Res3)
R93  value 10K  [RESC3225M]  (hidden comment: Res3)
R97  value 220  [RESC3225M]  (hidden comment: Res3)
U21  TL084ACD  [SO14_N]  (parts A,B,C,D of 4)
U22  TL084ACD  [SO14_N]  (parts A,B,C,D of 4)
U23  TPS71550  [SOT353-5L]

### Nets
FSR11: C39.1 P23.1 P23.3 P23.5 P23.7 P23.9 P23.11 P23.13 P23.15 U23.5(OUT)  [also labelled FSR21, FSR31, FSR41, FSR51, FSR61, FSR71, FSR81, VCC]
GND: C39.2 P22.1 P25.1 P26.1 P26.3 P26.5 P26.7 P26.9 P26.11 P26.13 P26.15 P26.17 P26.19 P38.1 R77.2 R78.2 R81.2 R82.2 R87.2 R88.2 R92.2 R93.2 U23.2(GND)  [also labelled PB101, PB11, PB21, PB31, PB41, PB51, PB61, PB71, PB81, PB91, VGND]  [project net BATMOT-]
FSR12: P23.2 R77.1 U21.2(IN-)
FSR22: P23.4 R81.1 U21.6(IN-)
FSR32: P23.6 R87.1 U21.9(IN-)
FSR42: P23.8 R92.1 U21.13(IN-)
FSR52: P23.10 R78.1 U22.2(IN-)
FSR62: P23.12 R82.1 U22.6(IN-)
FSR72: P23.14 R88.1 U22.9(IN-)
FSR82: P23.16 R93.1 U22.13(IN-)
PB12: P26.2 R79.1
PB22: P26.4 R80.1
PB32: P26.6 R83.1
PB42: P26.8 R84.1
PB52: P26.10 R85.1
PB62: P26.12 R86.1
PB72: P26.14 R89.1
PB82: P26.16 R90.1
PB92: P26.18 R91.1
PB102: P26.20 R97.1
PBOUT1: P38.2 R79.2
PBOUT2: P38.3 R80.2
PBOUT3: P38.4 R83.2
PBOUT4: P38.5 R84.2
PBOUT5: P38.6 R85.2
PBOUT6: P38.7 R86.2
PBOUT7: P38.8 R89.2
PBOUT8: P38.9 R90.2
PBOUT9: P38.10 R91.2
PBOUT10: P38.11 R97.2
V+: P22.3 U21.4(V+) U22.4(V+) U23.4(IN)  [project net BATCIR+]
V-: P22.2 U21.11(V-) U22.11(V-)  [project net BATCIR-]
VOFSR1: P25.2 U21.1(OUT) U21.3(IN+)
VOFSR2: P25.3 U21.5(IN+) U21.7(OUT)
VOFSR3: P25.4 U21.8(OUT) U21.10(IN+)
VOFSR4: P25.5 U21.12(IN+) U21.14(OUT)
VOFSR5: P25.6 U22.1(OUT) U22.3(IN+)
VOFSR6: P25.7 U22.5(IN+) U22.7(OUT)
VOFSR7: P25.8 U22.8(OUT) U22.10(IN+)
VOFSR8: P25.9 U22.12(IN+) U22.14(OUT)

Not connected (* = marked no-connect by the designer): U23 1(NC)* 3(NC)*

### Notes on the sheet
- INPUT
- FSR
- (near U23) LOGIC SUPPLY VOLTAGE
- (near R79) PB RESISTORS
- OUTPUT
- (in symbol TL084ACD, part A) A
- (in symbol TL084ACD, part B) B
- (in symbol TL084ACD, part C) C
- (in symbol TL084ACD, part D) D

### Library data of the parts
C39 = Cap Semi: Capacitor (Semiconductor SIM Model); Published: 8-Jun-2000; LatestRevisionDate: 29-May-2009; LatestRevisionNote: IPC-7351 Footprint Added.; PackageReference: C1206; Publisher: Altium Limited; PackageDescription: Chip Capacitor
P22 = Header 3: Header, 3-Pin; LatestRevisionDate: 17-Jul-2002; LatestRevisionNote: Re-released for DXP Platform.; Publisher: Altium Limited
P23 = Header 8X2: Header, 8-Pin, Dual row; LatestRevisionDate: 17-Jul-2002; LatestRevisionNote: Re-released for DXP Platform.; Publisher: Altium Limited
P25 = Header 9H: Header, 9-Pin, Right Angle; LatestRevisionDate: 17-Jul-2002; LatestRevisionNote: Re-released for DXP Platform.; Publisher: Altium Limited
P26 = Header 10X2: Header, 10-Pin, Dual row; LatestRevisionDate: 17-Jul-2002; LatestRevisionNote: Re-released for DXP Platform.; Publisher: Altium Limited
P38 = Header 11H: Header, 11-Pin, Right Angle; LatestRevisionDate: 17-Jul-2002; LatestRevisionNote: Re-released for DXP Platform.; Publisher: Altium Limited
R77-R93 R97 = Res3: Resistor; Published: 8-Jun-2000; LatestRevisionDate: 29-May-2009; LatestRevisionNote: IPC-7351 Footprint Added.; PackageReference: J1-0603; Publisher: Altium Limited; PackageDescription: Chip Resistor
U21 U22 = TL084ACD: General-Purpose J-FET Quad Operational Amplifier; Published: 24-Aug-2001; LatestRevisionDate: 13-Apr-2006; LatestRevisionNote: IPC-7351 Footprint Added.; DatasheetVersion: Jan-1999; PackageVersion: Sep-1998; PackageReference: SO14; Publisher: Altium Limited; PackageDescription: 14-Pin Small Outline Integrated Circuit 1.27 mm Pitch; Code_IPC: SOIC127P600-14; ComponentLink1Description: Manufacturer Link; ComponentLink1URL: http://www.st.com/; ComponentLink2Description: Datasheet; ComponentLink2URL: http://www.st.com/stonline/products/literature/ds/2301/tl084.pdf

## Sheet MCUPro.SchDoc
size A3
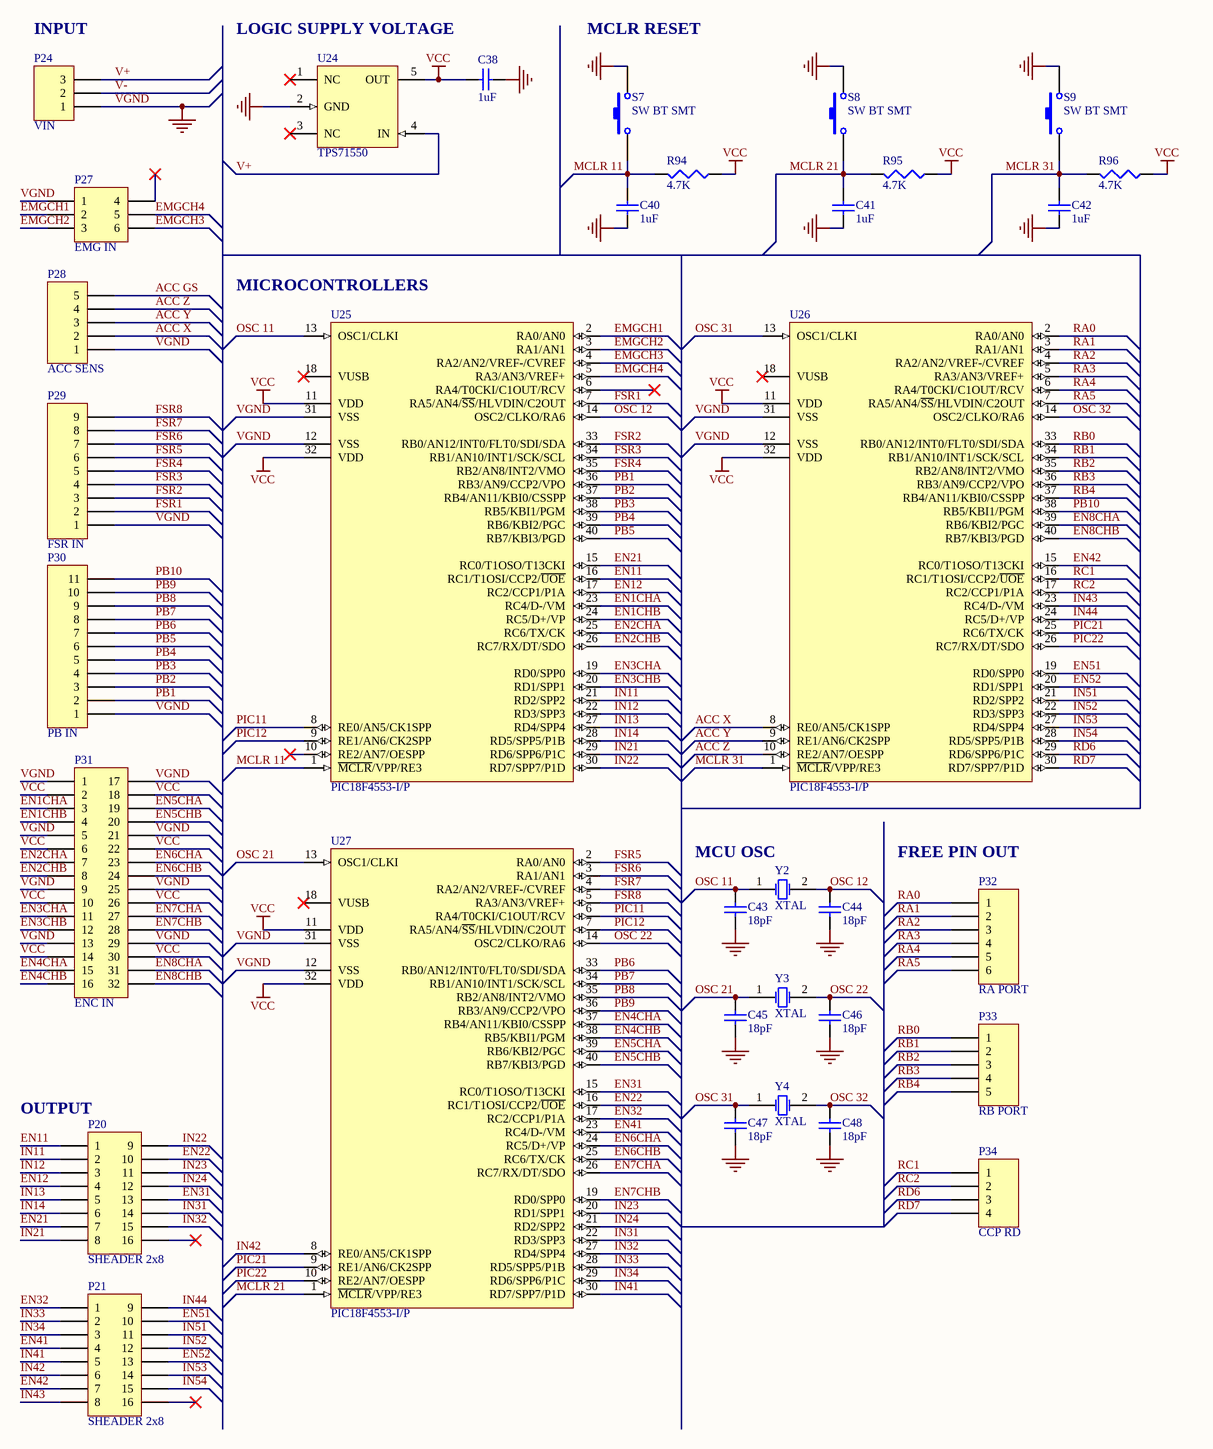
[diagram p4: MCUPro.SchDoc]

### Parts
C38  value 1uF  [CAPC2012M]  (hidden comment: Cap Semi)
C40  value 1uF  [CAPC2012M]  (hidden comment: Cap Semi)
C41  value 1uF  [CAPC2012M]  (hidden comment: Cap Semi)
C42  value 1uF  [CAPC2012M]  (hidden comment: Cap Semi)
C43  value 18pF  [C1206]  (hidden comment: Cap Semi)
C44  value 18pF  [C1206]  (hidden comment: Cap Semi)
C45  value 18pF  [C1206]  (hidden comment: Cap Semi)
C46  value 18pF  [C1206]  (hidden comment: Cap Semi)
C47  value 18pF  [C1206]  (hidden comment: Cap Semi)
C48  value 18pF  [C1206]  (hidden comment: Cap Semi)
P20  SHEADER 2x8  [SHBH 2X8]
P21  SHEADER 2x8  [SHBH 2X8]
P24  VIN  [AZUL5-3]
P27  EMG IN  [SHBH 2x3]
P28  ACC SENS  [HDR1X5H]
P29  FSR IN  [HDR1X9H]
P30  PB IN  [HDR1X11H]
P31  ENC IN  [HDR2X16_CEN]
P32  RA PORT  [AZUL5-6]
P33  RB PORT  [HDR1X5]
P34  CCP RD  [HDR1X4]
R94  value 4.7K  [RESC3225M]  (hidden comment: Res3)
R95  value 4.7K  [RESC3225M]  (hidden comment: Res3)
R96  value 4.7K  [RESC3225M]  (hidden comment: Res3)
S7  SW BT SMT  [PBOTTON SMT4]
S8  SW BT SMT  [PBOTTON SMT4]
S9  SW BT SMT  [PBOTTON SMT4]
U24  TPS71550  [SOT353-5L]
U25  PIC18F4553-I/P  [PDIP600-P40]
U26  PIC18F4553-I/P  [PDIP600-P40]
U27  PIC18F4553-I/P  [PDIP600-P40]
Y2  XTAL  [XTAL-1]
Y3  XTAL  [XTAL-1]
Y4  XTAL  [XTAL-1]

### Nets
GND: C38.2 C40.2 C41.2 C42.2 C43.2 C44.2 C45.2 C46.2 C47.2 C48.2 P24.1 P27.1 P28.1 P29.1 P30.1 P31.1 P31.5 P31.9 P31.13 P31.17 P31.21 P31.25 P31.29 S7.2 S8.2 S9.2 U24.2(GND) U25.12(VSS) U25.31(VSS) U26.12(VSS) U26.31(VSS) U27.12(VSS) U27.31(VSS)  [also labelled VGND]  [project net BATMOT-]
VCC: C38.1 P31.2 P31.6 P31.10 P31.14 P31.18 P31.22 P31.26 P31.30 R94.1 R95.1 R96.1 U24.5(OUT) U25.11(VDD) U25.32(VDD) U26.11(VDD) U26.32(VDD) U27.11(VDD) U27.32(VDD)  [project net FSR11]
ACC GS: P28.5
ACC X: P28.2 U26.8(RE0/AN5/CK1SPP)
ACC Y: P28.3 U26.9(RE1/AN6/CK2SPP)
ACC Z: P28.4 U26.10(RE2/AN7/OESPP)
EMGCH1: P27.2 U25.2(RA0/AN0)
EMGCH2: P27.3 U25.3(RA1/AN1)
EMGCH3: P27.6 U25.4(RA2/AN2/VREF-/CVREF)
EMGCH4: P27.5 U25.5(RA3/AN3/VREF+)
EN1CHA: P31.3 U25.23(RC4/D-/VM)
EN1CHB: P31.4 U25.24(RC5/D+/VP)
EN2CHA: P31.7 U25.25(RC6/TX/CK)
EN2CHB: P31.8 U25.26(RC7/RX/DT/SDO)
EN3CHA: P31.11 U25.19(RD0/SPP0)
EN3CHB: P31.12 U25.20(RD1/SPP1)
EN4CHA: P31.15 U27.37(RB4/AN11/KBI0/CSSPP)
EN4CHB: P31.16 U27.38(RB5/KBI1/PGM)
EN5CHA: P31.19 U27.39(RB6/KBI2/PGC)
EN5CHB: P31.20 U27.40(RB7/KBI3/PGD)
EN6CHA: P31.23 U27.24(RC5/D+/VP)
EN6CHB: P31.24 U27.25(RC6/TX/CK)
EN7CHA: P31.27 U27.26(RC7/RX/DT/SDO)
EN7CHB: P31.28 U27.19(RD0/SPP0)
EN8CHA: P31.31 U26.39(RB6/KBI2/PGC)
EN8CHB: P31.32 U26.40(RB7/KBI3/PGD)
EN11: P20.1 U25.16(RC1/T1OSI/CCP2/~{UOE})
EN12: P20.4 U25.17(RC2/CCP1/P1A)
EN21: P20.7 U25.15(RC0/T1OSO/T13CKI)
EN22: P20.10 U27.16(RC1/T1OSI/CCP2/~{UOE})
EN31: P20.13 U27.15(RC0/T1OSO/T13CKI)
EN32: P21.1 U27.17(RC2/CCP1/P1A)
EN41: P21.4 U27.23(RC4/D-/VM)
EN42: P21.7 U26.15(RC0/T1OSO/T13CKI)
EN51: P21.10 U26.19(RD0/SPP0)
EN52: P21.13 U26.20(RD1/SPP1)
FSR1: P29.2 U25.7(RA5/AN4/~{SS}/HLVDIN/C2OUT)
FSR2: P29.3 U25.33(RB0/AN12/INT0/FLT0/SDI/SDA)
FSR3: P29.4 U25.34(RB1/AN10/INT1/SCK/SCL)
FSR4: P29.5 U25.35(RB2/AN8/INT2/VMO)
FSR5: P29.6 U27.2(RA0/AN0)
FSR6: P29.7 U27.3(RA1/AN1)
FSR7: P29.8 U27.4(RA2/AN2/VREF-/CVREF)
FSR8: P29.9 U27.5(RA3/AN3/VREF+)
IN11: P20.2 U25.21(RD2/SPP2)
IN12: P20.3 U25.22(RD3/SPP3)
IN13: P20.5 U25.27(RD4/SPP4)
IN14: P20.6 U25.28(RD5/SPP5/P1B)
IN21: P20.8 U25.29(RD6/SPP6/P1C)
IN22: P20.9 U25.30(RD7/SPP7/P1D)
IN23: P20.11 U27.20(RD1/SPP1)
IN24: P20.12 U27.21(RD2/SPP2)
IN31: P20.14 U27.22(RD3/SPP3)
IN32: P20.15 U27.27(RD4/SPP4)
IN33: P21.2 U27.28(RD5/SPP5/P1B)
IN34: P21.3 U27.29(RD6/SPP6/P1C)
IN41: P21.5 U27.30(RD7/SPP7/P1D)
IN42: P21.6 U27.8(RE0/AN5/CK1SPP)
IN43: P21.8 U26.23(RC4/D-/VM)
IN44: P21.9 U26.24(RC5/D+/VP)
IN51: P21.11 U26.21(RD2/SPP2)
IN52: P21.12 U26.22(RD3/SPP3)
IN53: P21.14 U26.27(RD4/SPP4)
IN54: P21.15 U26.28(RD5/SPP5/P1B)
MCLR 11: C40.1 R94.2 S7.1 U25.1(~{MCLR}/VPP/RE3)
MCLR 21: C41.1 R95.2 S8.1 U27.1(~{MCLR}/VPP/RE3)
MCLR 31: C42.1 R96.2 S9.1 U26.1(~{MCLR}/VPP/RE3)
OSC 11: C43.1 U25.13(OSC1/CLKI) Y2.1(OSC1)
OSC 12: C44.1 U25.14(OSC2/CLKO/RA6) Y2.2(OSC2)
OSC 21: C45.1 U27.13(OSC1/CLKI) Y3.1(OSC1)
OSC 22: C46.1 U27.14(OSC2/CLKO/RA6) Y3.2(OSC2)
OSC 31: C47.1 U26.13(OSC1/CLKI) Y4.1(OSC1)
OSC 32: C48.1 U26.14(OSC2/CLKO/RA6) Y4.2(OSC2)
PB1: P30.2 U25.36(RB3/AN9/CCP2/VPO)
PB2: P30.3 U25.37(RB4/AN11/KBI0/CSSPP)
PB3: P30.4 U25.38(RB5/KBI1/PGM)
PB4: P30.5 U25.39(RB6/KBI2/PGC)
PB5: P30.6 U25.40(RB7/KBI3/PGD)
PB6: P30.7 U27.33(RB0/AN12/INT0/FLT0/SDI/SDA)
PB7: P30.8 U27.34(RB1/AN10/INT1/SCK/SCL)
PB8: P30.9 U27.35(RB2/AN8/INT2/VMO)
PB9: P30.10 U27.36(RB3/AN9/CCP2/VPO)
PB10: P30.11 U26.38(RB5/KBI1/PGM)
PIC11: U25.8(RE0/AN5/CK1SPP) U27.6(RA4/T0CKI/C1OUT/RCV)
PIC12: U25.9(RE1/AN6/CK2SPP) U27.7(RA5/AN4/~{SS}/HLVDIN/C2OUT)
PIC21: U26.25(RC6/TX/CK) U27.9(RE1/AN6/CK2SPP)
PIC22: U26.26(RC7/RX/DT/SDO) U27.10(RE2/AN7/OESPP)
RA0: P32.1 U26.2(RA0/AN0)
RA1: P32.2 U26.3(RA1/AN1)
RA2: P32.3 U26.4(RA2/AN2/VREF-/CVREF)
RA3: P32.4 U26.5(RA3/AN3/VREF+)
RA4: P32.5 U26.6(RA4/T0CKI/C1OUT/RCV)
RA5: P32.6 U26.7(RA5/AN4/~{SS}/HLVDIN/C2OUT)
RB0: P33.1 U26.33(RB0/AN12/INT0/FLT0/SDI/SDA)
RB1: P33.2 U26.34(RB1/AN10/INT1/SCK/SCL)
RB2: P33.3 U26.35(RB2/AN8/INT2/VMO)
RB3: P33.4 U26.36(RB3/AN9/CCP2/VPO)
RB4: P33.5 U26.37(RB4/AN11/KBI0/CSSPP)
RC1: P34.1 U26.16(RC1/T1OSI/CCP2/~{UOE})
RC2: P34.2 U26.17(RC2/CCP1/P1A)
RD6: P34.3 U26.29(RD6/SPP6/P1C)
RD7: P34.4 U26.30(RD7/SPP7/P1D)
V+: P24.3 U24.4(IN)  [project net BATCIR+]
V-: P24.2  [project net BATCIR-]

Not connected (* = marked no-connect by the designer): P20 16*; P21 16*; P27 4*; U24 1(NC)* 3(NC)*; U25 6(RA4/T0CKI/C1OUT/RCV)* 10(RE2/AN7/OESPP)* 18(VUSB)*; U26 18(VUSB)*; U27 18(VUSB)*

### Notes on the sheet
- (near P24) INPUT
- (near U24) LOGIC SUPPLY VOLTAGE
- MCLR RESET
- (near U25) MICROCONTROLLERS
- MCU OSC
- (near P32) FREE PIN OUT
- (near P20) OUTPUT

### Library data of the parts
C38 C40-C48 = Cap Semi: Capacitor (Semiconductor SIM Model); Published: 8-Jun-2000; LatestRevisionDate: 29-May-2009; LatestRevisionNote: IPC-7351 Footprint Added.; PackageReference: C1206; Publisher: Altium Limited; PackageDescription: Chip Capacitor
P20 P21 = SB Header 2x8: as P35 on sheet MDrive
P24 = Header 3: Header, 3-Pin; LatestRevisionDate: 17-Jul-2002; LatestRevisionNote: Re-released for DXP Platform.; Publisher: Altium Limited
P27 = SB Header 2x3: as P4 on sheet EmgAcq
P28 = Header 5H: Header, 5-Pin, Right Angle; LatestRevisionDate: 17-Jul-2002; LatestRevisionNote: Re-released for DXP Platform.; Publisher: Altium Limited
P29 = Header 9H: Header, 9-Pin, Right Angle; LatestRevisionDate: 17-Jul-2002; LatestRevisionNote: Re-released for DXP Platform.; Publisher: Altium Limited
P30 = Header 11H: Header, 11-Pin, Right Angle; LatestRevisionDate: 17-Jul-2002; LatestRevisionNote: Re-released for DXP Platform.; Publisher: Altium Limited
P31 = Header 16X2A: Header, 16-Pin, Dual row; LatestRevisionDate: 17-Jul-2002; LatestRevisionNote: Re-released for DXP Platform.; Publisher: Altium Limited
P32 = Header 6: Header, 6-Pin; LatestRevisionDate: 17-Jul-2002; LatestRevisionNote: Re-released for DXP Platform.; Publisher: Altium Limited
P33 = Header 5: Header, 5-Pin; LatestRevisionDate: 17-Jul-2002; LatestRevisionNote: Re-released for DXP Platform.; Publisher: Altium Limited
P34 = Header 4: Header, 4-Pin; LatestRevisionDate: 17-Jul-2002; LatestRevisionNote: Re-released for DXP Platform.; Publisher: Altium Limited
R94-R96 = Res3: Resistor; Published: 8-Jun-2000; LatestRevisionDate: 29-May-2009; LatestRevisionNote: IPC-7351 Footprint Added.; PackageReference: J1-0603; Publisher: Altium Limited; PackageDescription: Chip Resistor
S7-S9 = SW PB 6mm: Pushbutton Switches FSM2JSMAASTR=6MM TACT SWITCH,
U25-U27 = PIC18F4553-I/P: High Performance, Enhanced Flash, USB Microcontroller with 12-Bit A/D and nanoWatt Technology, 32K Flash, 40-Pin PDIP, Industrial Temperature Range; Published: 29-Jan-2009; DatasheetVersion: revB, Jul-2007; PackageVersion: revAW, Oct-2008; PackageReference: PDIP600-P40; Publisher: Altium Limited; PackageDescription: 40-Lead Plastic Dual In-Line (P) - 600 mil Body [PDIP]; ComponentLink1Description: Manufacturer Link; ComponentLink1URL: http://www.microchip.com; ComponentLink2Description: Datasheet; ComponentLink2URL: http://ww1.microchip.com/downloads/en/DeviceDoc/39887b.pdf; ComponentLink3Description: Packaging Specification; ComponentLink3URL: http://ww1.microchip.com/downloads/en/PackagingSpec/00049AW.pdf
Y2-Y4 = XTAL: Crystal Oscillator; Published: 8-Jun-2000; LatestRevisionDate: 17-Jul-2002; LatestRevisionNote: Re-released for DXP Platform.; PackageReference: R38; Publisher: Altium Limited; PackageDescription: Crystal, Thru-Hole; 2 Leads; Body 3.1 x 8.2 mm (Dia.xH)

## Nets that join several sheets
BATMOT-: PowerScr (16 pins), EmgAcq (40 pins), MDrive (45 pins), Hand Sensors (23 pins), MCUPro (33 pins)
FSR11: MDrive (7 pins), Hand Sensors (10 pins), MCUPro (19 pins)
BATCIR+: PowerScr (C31.1 P5.2 P6.3 U12.3), EmgAcq (13 pins), MDrive (P7.2), Hand Sensors (P22.3 U21.4 U22.4 U23.4), MCUPro (P24.3 U24.4)
BATCIR-: PowerScr (5 pins), EmgAcq (13 pins), Hand Sensors (P22.2 U21.11 U22.11), MCUPro (P24.2)
EMGCH1: EmgAcq (P4.2), MCUPro (P27.2 U25.2)
EMGCH2: EmgAcq (P4.3), MCUPro (P27.3 U25.3)
EMGCH3: EmgAcq (P4.6), MCUPro (P27.6 U25.4)
EMGCH4: EmgAcq (P4.5), MCUPro (P27.5 U25.5)
EN11: MDrive (P35.1 U15.1), MCUPro (P20.1 U25.16)
EN12: MDrive (P35.4 U15.11), MCUPro (P20.4 U25.17)
EN21: MDrive (P35.7 U16.1), MCUPro (P20.7 U25.15)
EN22: MDrive (P35.10 U16.11), MCUPro (P20.10 U27.16)
EN31: MDrive (P35.13 U17.1), MCUPro (P20.13 U27.15)
EN32: MDrive (P36.1 U17.11), MCUPro (P21.1 U27.17)
EN41: MDrive (P36.4 U18.1), MCUPro (P21.4 U27.23)
EN42: MDrive (P36.7 U18.11), MCUPro (P21.7 U26.15)
EN51: MDrive (P36.10 U20.1), MCUPro (P21.10 U26.19)
EN52: MDrive (P36.13 U20.9), MCUPro (P21.13 U26.20)
IN11: MDrive (P35.2 U15.2), MCUPro (P20.2 U25.21)
IN12: MDrive (P35.3 U15.9), MCUPro (P20.3 U25.22)
IN13: MDrive (P35.5 U15.12), MCUPro (P20.5 U25.27)
IN14: MDrive (P35.6 U15.19), MCUPro (P20.6 U25.28)
IN21: MDrive (P35.8 U16.2), MCUPro (P20.8 U25.29)
IN22: MDrive (P35.9 U16.9), MCUPro (P20.9 U25.30)
IN23: MDrive (P35.11 U16.12), MCUPro (P20.11 U27.20)
IN24: MDrive (P35.12 U16.19), MCUPro (P20.12 U27.21)
IN31: MDrive (P35.14 U17.2), MCUPro (P20.14 U27.22)
IN32: MDrive (P35.15 U17.9), MCUPro (P20.15 U27.27)
IN33: MDrive (P36.2 U17.12), MCUPro (P21.2 U27.28)
IN34: MDrive (P36.3 U17.19), MCUPro (P21.3 U27.29)
IN41: MDrive (P36.5 U18.2), MCUPro (P21.5 U27.30)
IN42: MDrive (P36.6 U18.9), MCUPro (P21.6 U27.8)
IN43: MDrive (P36.8 U18.12), MCUPro (P21.8 U26.23)
IN44: MDrive (P36.9 U18.19), MCUPro (P21.9 U26.24)
IN51: MDrive (P36.11 U20.2), MCUPro (P21.11 U26.21)
IN52: MDrive (P36.12 U20.7), MCUPro (P21.12 U26.22)
IN53: MDrive (P36.14 U20.10), MCUPro (P21.14 U26.27)
IN54: MDrive (P36.15 U20.15), MCUPro (P21.15 U26.28)
VM+: PowerScr (6 pins), MDrive (5 pins)
VSTP+: PowerScr (6 pins), MDrive (6 pins)